# Altium schematic sheet 01.Index.SchDoc: Index Page
size A3; DrawnBy: My My; Revision: 1.1; SheetNumber: 1; SheetTotal: 4
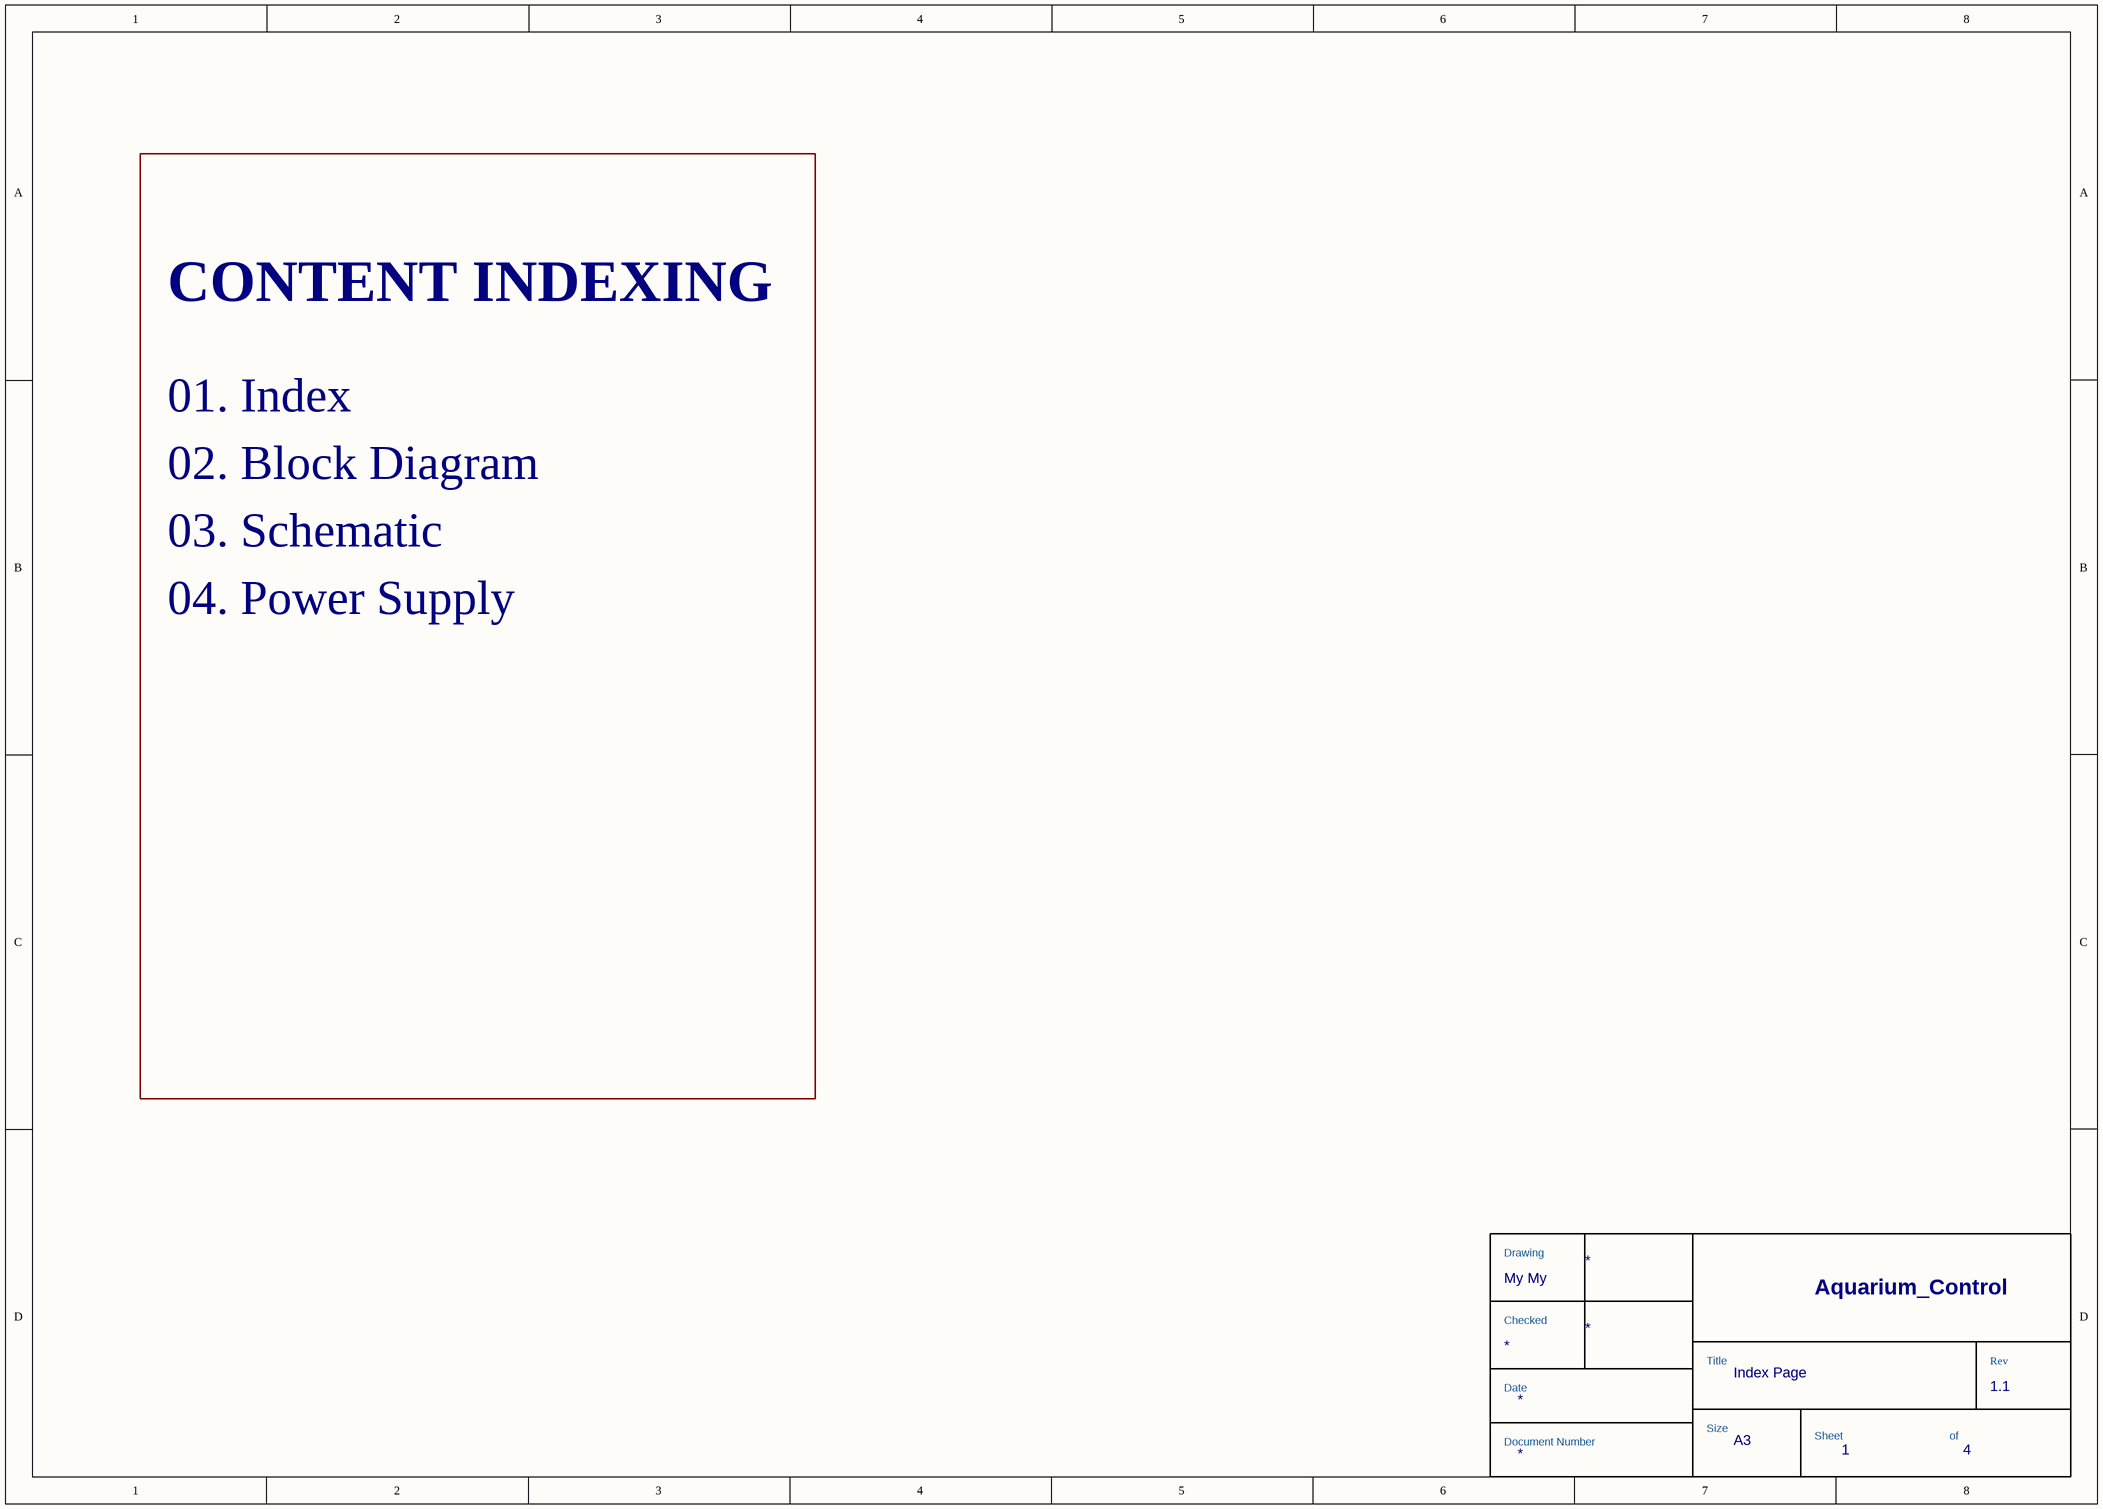
[diagram p0: 01.Index.SchDoc]

## Parts
*  TitleBlock  (value not drawn)  (graphical)

## Notes on the sheet
- CONTENT INDEXING
- 01. Index
- 02. Block Diagram
- 03. Schematic
- 04. Power Supply
- (in symbol TitleBlock) Drawing; Aquarium_Control; Checked; Title; Rev; Date; Size; Sheet; of; Document Number; A3

## Library data of the parts
* = TitleBlock: Common Title Block